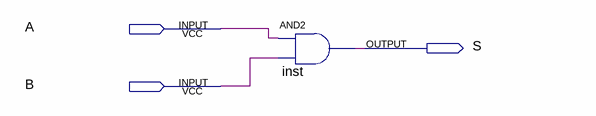
[diagram p0: schematic sheet]
// Quartus schematic porte_et_q9.bdf as structural Verilog: 1 symbols, 3 pins
module porte_et_q9 (
  input  A,
  input  B,
  output S
);

  and inst (S, A, B);
endmodule
